# EAGLE design RGB-TestPatternGenerator (EAGLE 9.6.2)
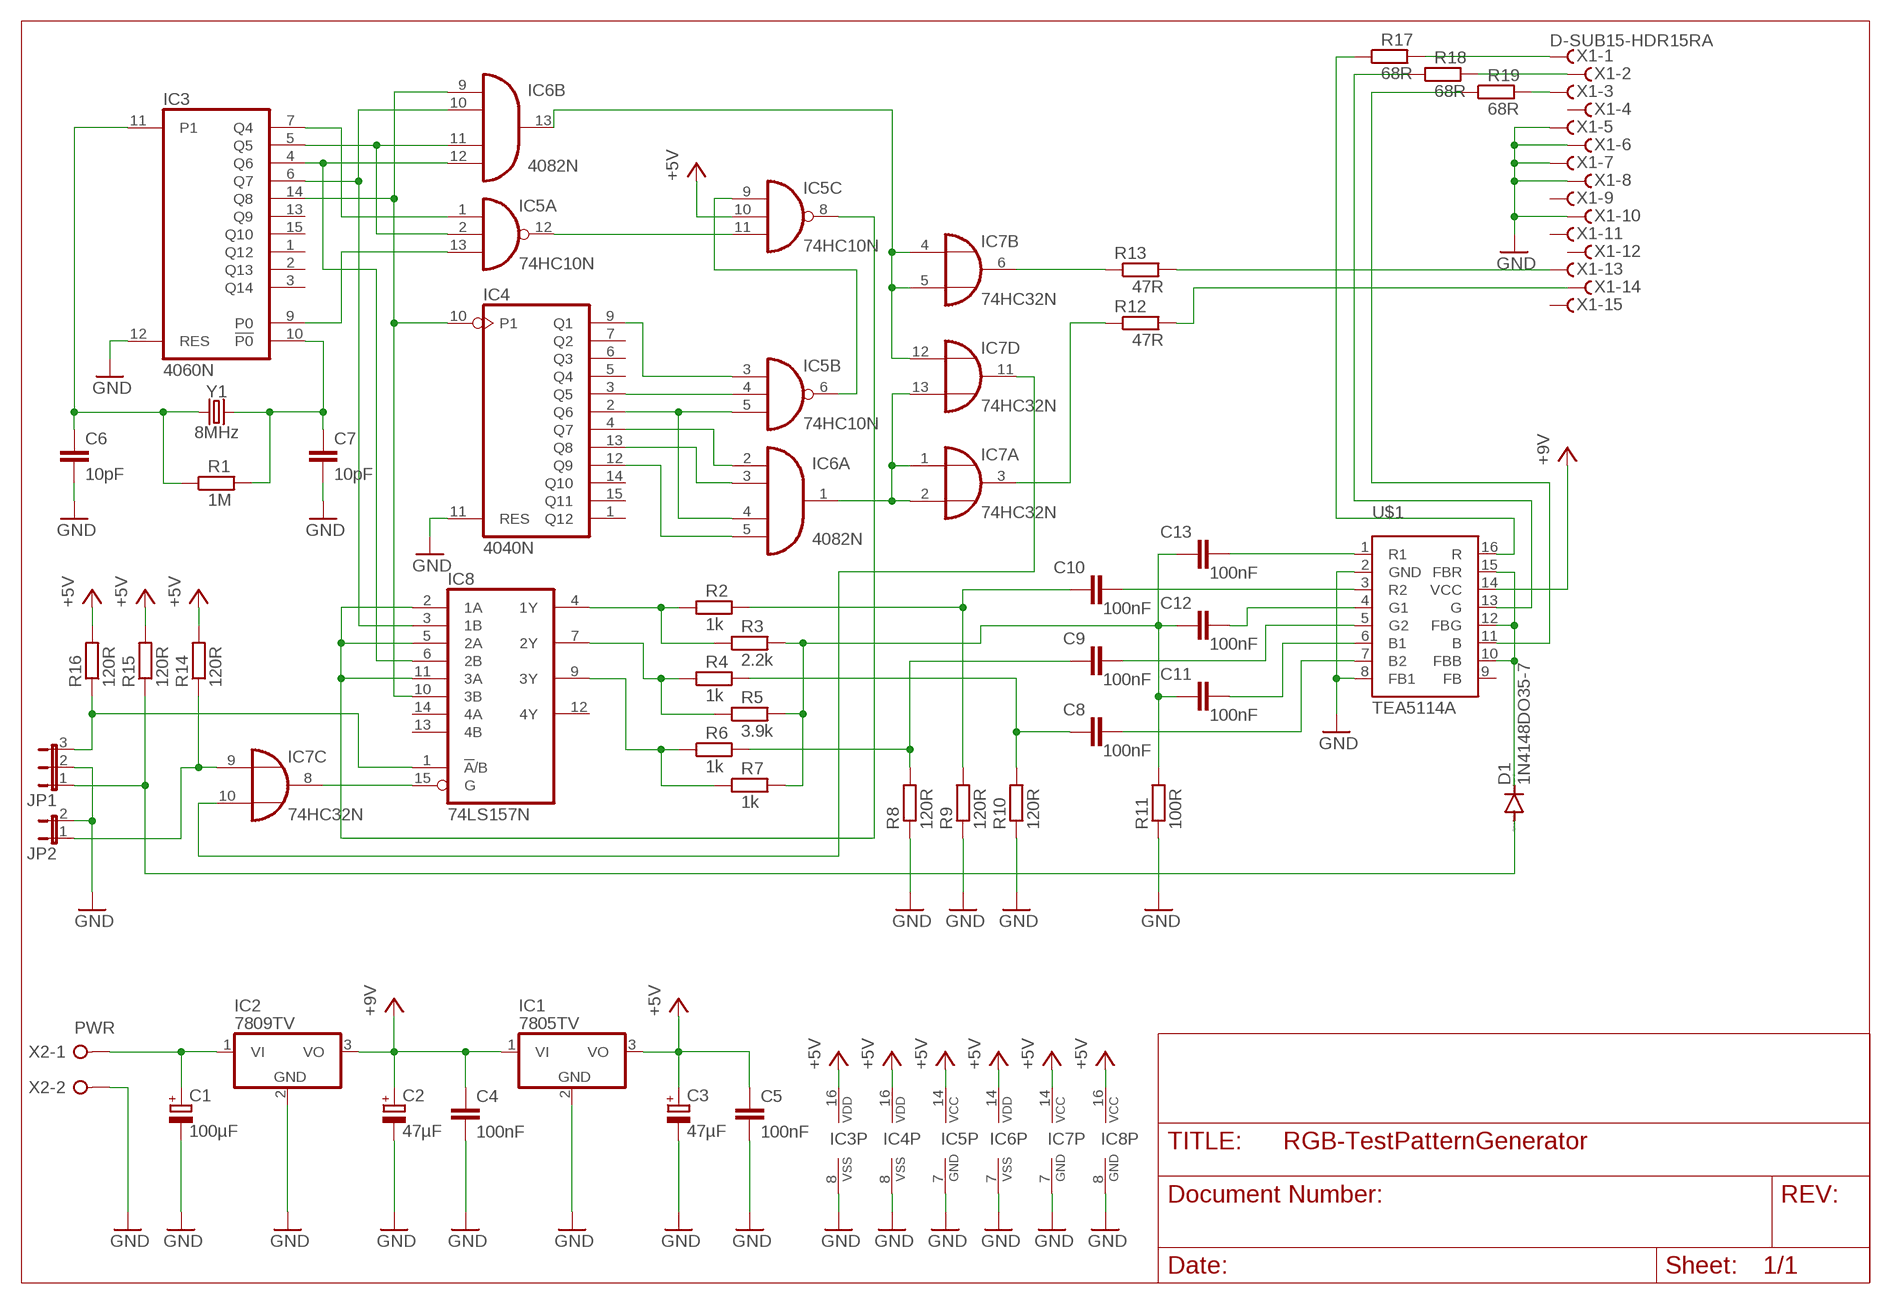
[diagram p0: schematic, sheet 1]

## Parts
C1  100µF  CPOL-EUE2,5-6E  [E2,5-6E]
C2  47µF  CPOL-EUE2-5  [E2-5]
C3  47µF  CPOL-EUE2-5  [E2-5]
C4  100nF  C-EU050-024X044  [C050-024X044]
C5  100nF  C-EU050-024X044  [C050-024X044]
C6  10pF  C-EU050-024X044  [C050-024X044]
C7  10pF  C-EU050-024X044  [C050-024X044]
C8  100nF  C-EU050-024X044  [C050-024X044]
C9  100nF  C-EU050-024X044  [C050-024X044]
C10  100nF  C-EU050-024X044  [C050-024X044]
C11  100nF  C-EU050-024X044  [C050-024X044]
C12  100nF  C-EU050-024X044  [C050-024X044]
C13  100nF  C-EU050-024X044  [C050-024X044]
D1  1N4148DO35-7  [DO35-7]
IC1  7805TV  [TO220V]
IC2  7809TV  7805TV  [TO220V]
IC3  4060N  [DIL16]
IC4  4040N  [DIL16]
IC5  74HC10N  [DIL14]
IC6  4082N  [DIL14]
IC7  74HC32N  [DIL14]
IC8  74LS157N  [DIL16]
JP1  JP2E  [JP2]
JP2  JP1E  [JP1]
R1  1M  R-EU_0207/10  [0207/10]
R2  1k  R-EU_0207/10  [0207/10]
R3  2.2k  R-EU_0207/10  [0207/10]
R4  1k  R-EU_0207/10  [0207/10]
R5  3.9k  R-EU_0207/10  [0207/10]
R6  1k  R-EU_0207/10  [0207/10]
R7  1k  R-EU_0207/10  [0207/10]
R8  120R  R-EU_0207/10  [0207/10]
R9  120R  R-EU_0207/10  [0207/10]
R10  120R  R-EU_0207/10  [0207/10]
R11  100R  R-EU_0207/10  [0207/10]
R12  47R  R-EU_0207/10  [0207/10]
R13  47R  R-EU_0207/10  [0207/10]
R14  120R  R-EU_0207/10  [0207/10]
R15  120R  R-EU_0207/10  [0207/10]
R16  120R  R-EU_0207/10  [0207/10]
R17  68R  R-EU_0207/10  [0207/10]
R18  68R  R-EU_0207/10  [0207/10]
R19  68R  R-EU_0207/10  [0207/10]
U$1  TEA5114A  RGBTEA5114A  [TEA5114A]
X1  D-SUB15-HDR15RA  [HDR15RA]
X2  PWR  W237-02P  [W237-132]
Y1  8MHz  CRYSTALPTH-HC49US  [HC49US]

## Nets
+5V: C3.+ C5.1 IC1.3(VO) IC3.16(VDD) IC4.16(VDD) IC5.10(C:I1) IC5.14(P:VCC) IC6.14(P:VDD) IC7.14(P:VCC) IC8.16(VCC) R14.2 R15.2 R16.2
GND: C1.- C2.- C3.- C4.2 C5.2 C6.2 C7.2 IC1.2(GND) IC2.2(GND) IC3.8(VSS) IC3.12(RES) IC4.8(VSS) IC4.11(RES) IC5.7(P:GND) IC6.7(P:VSS) IC7.7(P:GND) IC8.8(GND) JP1.2 JP2.2 R8.1 R9.1 R10.1 R11.1 U$1.2(GND) U$1.8(FB1) X1.5 X1.6 X1.7 X1.8 X1.10 X2.2
N$1: C1.+ IC2.1(VI) X2.1
N$2: C6.1 IC3.11(P1) R1.1 Y1.1
N$3: C7.1 IC3.10(!P0) R1.2 Y1.2
N$4: IC3.5(Q5) IC5.2(A:I1) IC6.11(B:I2)
N$5: IC3.4(Q6) IC6.12(B:I3) IC8.6(2B)
N$6: IC3.7(Q4) IC5.1(A:I0)
N$7: IC3.9(P0) IC5.13(A:I2)
N$8: IC3.6(Q7) IC6.10(B:I1) IC8.3(1B)
N$9: IC3.14(Q8) IC4.10(P1) IC6.9(B:I0) IC8.10(3B)
N$10: IC5.8(C:O) IC8.2(1A) IC8.5(2A) IC8.11(3A)
N$11: IC7.8(C:O) IC8.15(G)
N$12: IC4.2(Q6) IC5.5(B:I2) IC6.4(A:I2)
N$13: IC4.3(Q5) IC5.4(B:I1)
N$14: IC4.9(Q1) IC5.3(B:I0)
N$15: IC4.4(Q7) IC6.2(A:I0)
N$16: IC4.13(Q8) IC6.3(A:I1)
N$17: IC5.11(C:I2) IC5.12(A:O)
N$18: IC4.12(Q9) IC6.5(A:I3)
N$19: IC5.6(B:O) IC5.9(C:I0)
N$20: IC6.1(A:O) IC7.1(A:I0) IC7.2(A:I1) IC7.13(D:I1)
N$21: IC8.4(1Y) R2.1 R3.1
N$22: IC6.13(B:O) IC7.4(B:I0) IC7.5(B:I1) IC7.12(D:I0)
N$23: IC8.7(2Y) R4.1 R5.1
N$24: IC8.9(3Y) R6.1 R7.1
N$25: C11.1 C12.1 C13.1 R3.2 R5.2 R7.2 R11.2
N$26: C9.1 R6.2 R8.2
N$27: C10.1 R2.2 R9.2
N$28: C8.1 R4.2 R10.2
N$29: IC7.10(C:I1) IC7.11(D:O)
N$30: IC7.6(B:O) R13.1
N$31: IC7.3(A:O) R12.1
N$32: IC7.9(C:I0) JP2.1 R14.1
N$33: IC8.1(!A!/B) JP1.3 R16.1
N$34: R13.2 X1.13
N$35: R12.2 X1.14
N$36: R17.2 X1.1
N$37: D1.A JP1.1 R15.1
N$38: R18.2 X1.2
N$39: R19.2 X1.3
N$40: R17.1 U$1.16(R)
N$41: R18.1 U$1.13(G)
N$42: R19.1 U$1.11(B)
N$43: C13.2 U$1.1(R1)
N$44: C10.2 U$1.3(R2)
N$45: C12.2 U$1.4(G1)
N$46: C9.2 U$1.5(G2)
N$47: C11.2 U$1.6(B1)
N$48: C8.2 U$1.7(B2)
N$49: D1.C U$1.10(FBB) U$1.12(FBG) U$1.15(FBR)
VCC: C2.+ C4.1 IC1.1(VI) IC2.3(VO) U$1.14(VCC) ; supply symbol labelled +9V
Unconnected: IC3.1(Q12) IC3.2(Q13) IC3.3(Q14) IC3.13(Q9) IC3.15(Q10) IC4.1(Q12) IC4.5(Q4) IC4.6(Q3) IC4.7(Q2) IC4.14(Q10) IC4.15(Q11) IC8.12(4Y) IC8.13(4B) IC8.14(4A) U$1.9(FB) X1.4 X1.9 X1.11 X1.12 X1.15

## Library data of the parts
C1-C3 = rcl:CPOL-EU: POLARIZED CAPACITOR, European symbol; SPICEPREFIX: C
C4-C13 = rcl:C-EU: CAPACITOR, European symbol; SPICEPREFIX: C
D1 = diode:1N4148: DIODE high speed (Philips)
IC1 IC2 = linear:78*: Positive VOLTAGE REGULATOR Source: http://cache.national.com/ds/LM/LM78L05.pdf http://www.fairchildsemi.com/ds/LM/LM7805.pdf
IC3 = 40xx:4060: 14-stage binary/ripple COUNTER
IC4 = 40xx:4040: 12-stage binary/ripple COUNTER
IC5 = 74xx-eu:74*10: Triple 3-input NAND gate
IC6 = 40xx:4082: Dual 4-input AND
IC7 = 74xx-eu:74*32: Quad 2-input OR gate
IC8 = 74xx-eu:74*157: Quadruple 2-line to 1-line data SELECTOR/MULTIPLEXER
JP1 = jumper:JP2E: JUMPER
JP2 = jumper:JP1E: JUMPER
R1-R19 = rcl:R-EU_: RESISTOR, European symbol; SPICEPREFIX: R
U$1 = bb84:RGB: This integrated circuit provides RGB switching allowing connections between peri TV plug, internal RGB generator and video processor in a TV set. The input signal black level is tied to the same reference voltageon each input in order to haveno differential voltage when switching two RGB generators. An AC output signal higher than 2 Vpp makes gain goingslowly down to 0dBto protect the TV set video amplifier from saturation. Fast blanking output is a logicial OR between FB1 (Pin 8) and FB2 (Pin 10). 1996 SGS-THOMSON Microelectronics - All Rights Reserved
X1 = con-thomas-betts:D-SUB15-: D-Subminiatur Connector Source: Electronioc Interconnects European Edition 1998; OC_FARNELL: unknown; OC_NEWARK: unknown
X2 = con-wago-508:W237-02P: WAGO SREW CLAMP; OC_FARNELL: unknown; OC_NEWARK: unknown
Y1 = SparkFun-Clocks:CRYSTAL: Crystals (Generic) These are passive quartz crystals, which can be used as a clock source for a microcontroller. Crystal's are two-terminal devices. They require external "load" capacitors to generate an oscillating signal.

## Board
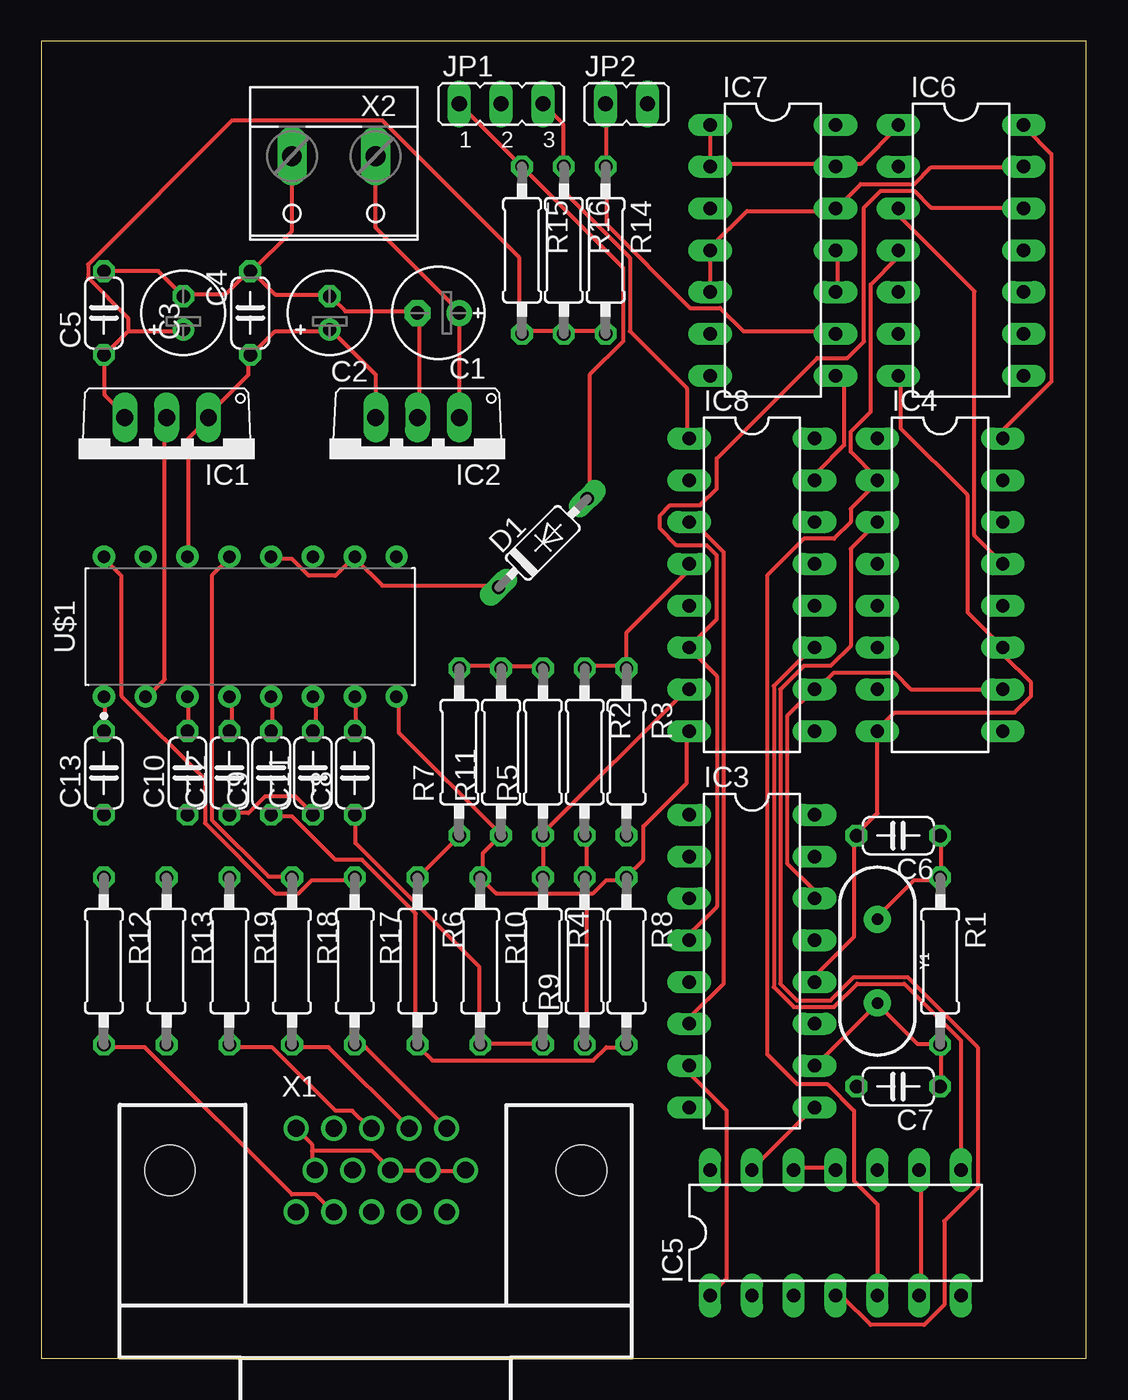
[diagram p1: board, top side]
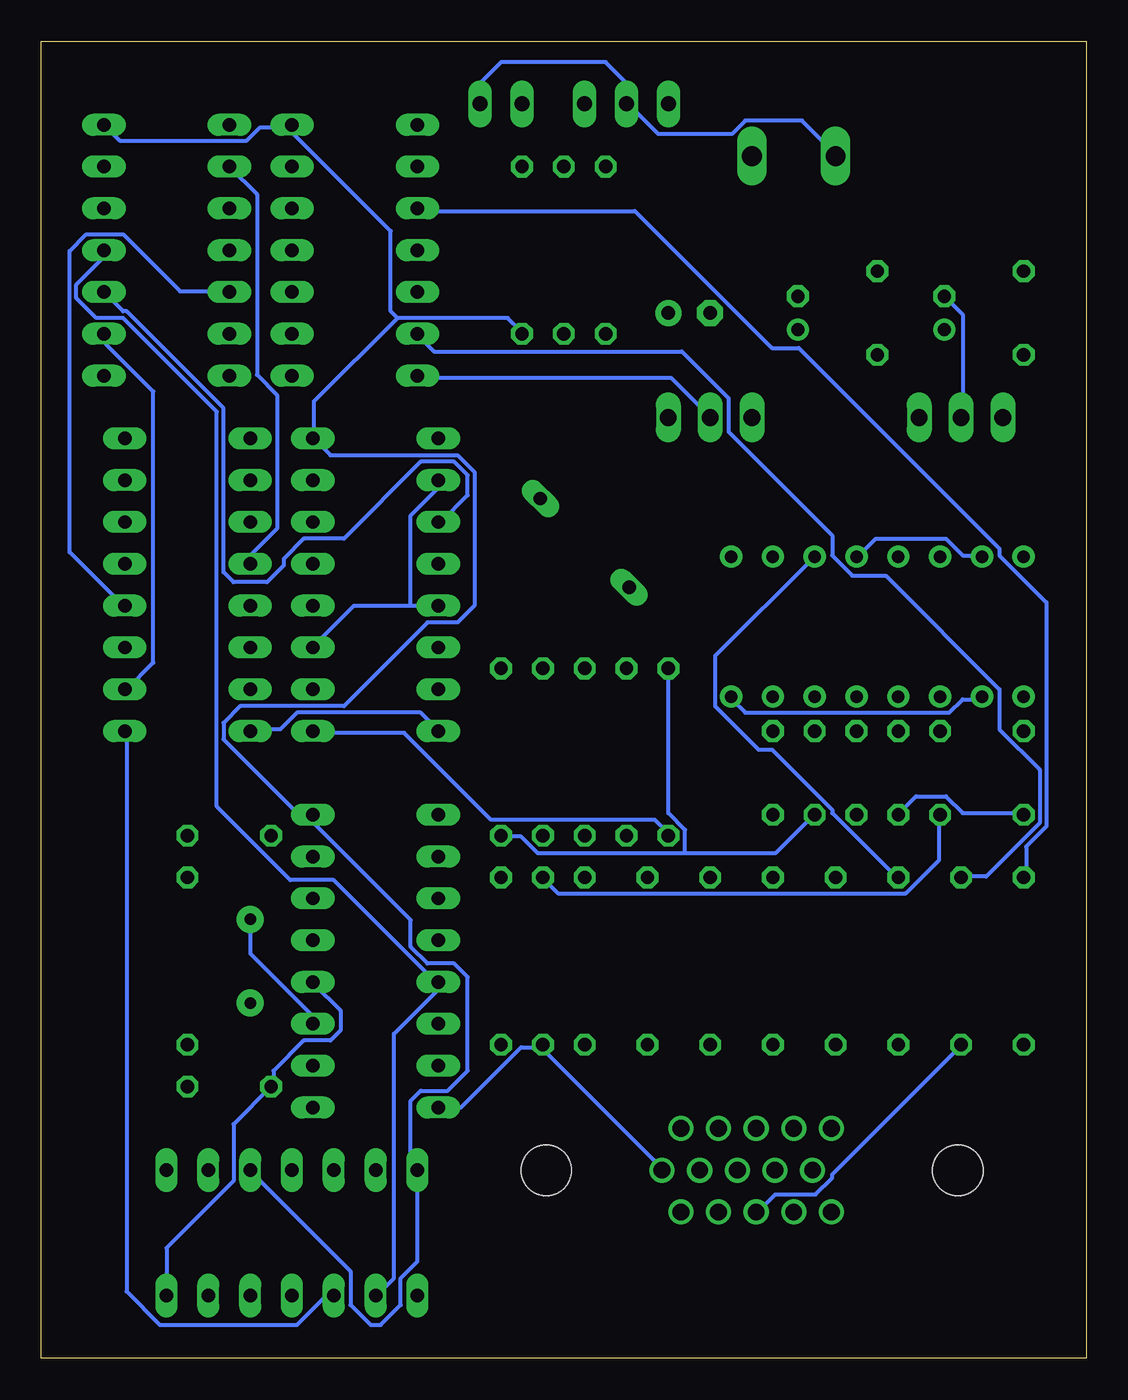
[diagram p2: board, bottom side, seen from below]

Size 63.5 x 80.01 mm. Coordinates in mm from the lower left corner, seen from the top.
Outline: 0,0 63.5,0 63.5,80.01 0,80.01 0,0
Copper layers (1*16): Top 0.035mm / dielectric 1.5mm / Bottom 0.035mm
Design rules "default *": minimum track width 10mil, minimum drill 0.35mm, track to track 6mil, track to pad 6mil, pad to pad 6mil, via to via 6mil, smd to smd 6mil, copper to edge 40mil, drill to drill 6mil, minimum pad ring 10mil, minimum via ring 8mil, stop-mask expansion 4mil, vias tented up to drill 0mil, thermal gap 10mil

### Footprints (pad centres in the part's own frame; a part is rotated, then mirrored left to right if it is on the bottom)
E2,5-6E = drill 0.813 pad 1.575: + -1.27,0 | drill 0.813 pad 1.575 octagon: - 1.27,0
E2-5 = drill 0.813 pad 1.27: + -1.016,0 | drill 0.813 pad 1.27 octagon: - 1.016,0
C050-024X044 = drill 0.813 octagon: 1 -2.54,0; 2 2.54,0
DO35-7 = drill 0.813 long: A 3.81,0; C -3.81,0
TO220V = drill 1.016 long: 1 -2.54,-2.54; 2 0,-2.54; 3 2.54,-2.54
DIL16 = drill 0.813 long: 1 -8.89,-3.81; 2 -6.35,-3.81; 3 -3.81,-3.81; 4 -1.27,-3.81; 5 1.27,-3.81; 6 3.81,-3.81; 7 6.35,-3.81; 8 8.89,-3.81; 9 8.89,3.81; 10 6.35,3.81; 11 3.81,3.81; 12 1.27,3.81; 13 -1.27,3.81; 14 -3.81,3.81; 15 -6.35,3.81; 16 -8.89,3.81
DIL14 = drill 0.813 long: 1 -7.62,-3.81; 2 -5.08,-3.81; 3 -2.54,-3.81; 4 0,-3.81; 5 2.54,-3.81; 6 5.08,-3.81; 7 7.62,-3.81; 8 7.62,3.81; 9 5.08,3.81; 10 2.54,3.81; 11 0,3.81; 12 -2.54,3.81; 13 -5.08,3.81; 14 -7.62,3.81
JP2 = drill 0.914 long: 1 -2.54,0; 2 0,0; 3 2.54,0
JP1 = drill 0.914 long: 1 0,-1.27; 2 0,1.27
0207/10 = drill 0.813 octagon: 1 -5.08,0; 2 5.08,0
TEA5114A = drill 0.759 pad 1.359: 1 -4.25,8.89; 2 -4.25,6.35; 3 -4.25,3.81; 4 -4.25,1.27; 5 -4.25,-1.27; 6 -4.25,-3.81; 7 -4.25,-6.35; 8 -4.25,-8.89; 9 4.25,-8.89; 10 4.25,-6.35; 11 4.25,-3.81; 12 4.25,-1.27; 13 4.25,1.27; 14 4.25,3.81; 15 4.25,6.35; 16 4.25,8.89
HDR15RA = drill 1.016: 1 4.318,2.54; 2 2.032,2.54; 3 -0.254,2.54; 4 -2.54,2.54; 5 -4.826,2.54; 6 5.461,0; 7 3.175,0; 8 0.889,0; 9 -1.397,0; 10 -3.683,0; 11 4.318,-2.54; 12 2.032,-2.54; 13 -0.254,-2.54; 14 -2.54,-2.54; 15 -4.826,-2.54 | hole 3.048: -12.497,0; 12.497,0
W237-132 = drill 1.194 long: 1 -2.54,-0.635; 2 2.54,-0.635
HC49US = drill 0.7 pad 1.651: 1 -2.54,0; 2 2.54,0

### Placement (x,y rotation side)
C1  24.13,63.5 180 top
C2  17.53,63.5 90 top
C3  8.64,63.5 90 top
C4  12.7,63.5 90 top
C5  3.81,63.5 90 top
C6  52.07,31.75 180 top
C7  52.07,16.51 180 top
C8  19.05,35.56 90 top
C9  13.97,35.56 90 top
C10  8.89,35.56 90 top
C11  16.51,35.56 90 top
C12  11.43,35.56 90 top
C13  3.81,35.56 90 top
D1  30.48,49.53 45 top
IC1  7.62,54.61 180 top
IC2  22.86,54.61 180 top
IC3  43.18,24.13 270 top
IC4  54.61,46.99 270 top
IC5  48.26,7.62 0 top
IC6  55.88,67.31 270 top
IC7  44.45,67.31 270 top
IC8  43.18,46.99 270 top
JP1  27.94,76.2 0 top
JP2  35.56,76.2 270 top
R1  54.61,24.13 270 top
R2  33.02,36.83 270 top
R3  35.56,36.83 270 top
R4  30.48,24.13 270 top
R5  30.48,36.83 90 top
R6  22.86,24.13 270 top
R7  25.4,36.83 90 top
R8  35.56,24.13 270 top
R9  33.02,24.13 90 top
R10  26.67,24.13 270 top
R11  27.94,36.83 90 top
R12  3.81,24.13 270 top
R13  7.62,24.13 270 top
R14  34.29,67.31 270 top
R15  29.21,67.31 270 top
R16  31.75,67.31 270 top
R17  19.05,24.13 270 top
R18  15.24,24.13 270 top
R19  11.43,24.13 270 top
U$1  12.7,44.45 90 top
X1  20.32,11.43 0 top
X2  17.78,72.39 180 top
Y1  50.8,24.13 270 top

### Tracks (layer width: path | path; a pad name or v marks a point on that pad's centre or on a via)
+5V
  Top 0.254: IC4.16 58.52,55.88 58.52,56.49 61.37,59.33 61.37,73.15 59.74,74.78 IC6.14 | 3.86,60.96 3.86,58.52 5.08,57.3 IC1.3 | 5.28,62.38 8.53,62.38 C3.+ | 3.86,60.96 5.28,62.38 | 3.86,60.96 C5.1 | R14.2 34.14,62.38 31.9,62.38 R16.2 31.7,62.38 29.26,62.38 R15.2 29.06,62.38 29.06,66.85 20.73,75.18 11.58,75.18 2.85,66.45 2.85,65.63 5.28,63.2 5.28,62.38
  Bottom 0.254: IC5.10 50.8,11.38 44.7,5.28 44.7,3.25 43.48,2.03 42.88,2.03 41.66,3.25 41.66,4.88 40.64,5.89 IC5.14 40.64,11.58 41.05,11.99 41.05,15.65 40.44,16.26 38.81,16.26 37.59,17.48 37.59,23.16 38.41,23.98 40.03,23.98 41.05,24.99 41.05,26.62 46.94,32.51 46.94,32.92 IC3.16 47.14,33.12 47.95,33.12 52.43,37.59 52.43,38.61 51.41,39.62 45.11,39.62 40.03,44.7 38.2,44.7 37.19,45.72 37.19,53.85 38.2,54.86 45.92,54.86 46.94,55.88 | IC6.14 58.73,73.97 51,73.97 50.19,74.78 48.36,74.78 IC7.14 48.16,74.78 48.16,74.37 42.27,68.48 42.27,63.6 41.86,63.2 | 46.94,55.88 46.94,58.12 41.86,63.2 | 41.86,63.2 35.15,63.2 34.34,62.38 R14.2 | 46.94,55.88 IC8.16
GND
  Top 0.254: IC3.12 47.14,22.96 47.14,23.37 49.38,25.6 49.38,31.7 C6.2 49.58,31.9 50.8,33.12 IC4.8 50.8,38.2 51.82,39.22 59.13,39.22 60.15,40.23 60.15,41.05 58.52,42.67 58.52,43.08 IC4.11 56.29,45.31 56.29,52.43 52.22,56.49 52.22,59.54 IC6.7 | C5.2 7.11,66.04 C3.- 8.74,64.62 11.18,64.62 12.6,66.04 C4.2 12.8,66.04 | 12.8,66.04 14.22,64.62 17.48,64.62 C2.- 17.68,64.41 18.49,63.6 22.76,63.6 C1.- 22.96,63.4 22.96,57.3 IC2.2 | X2.2 15.24,68.48 12.8,66.04 | 16.46,12.6 16.46,13.01 X1.5 | 16.46,12.6 16.46,11.58 X1.10 | X1.6 25.6,11.38 23.57,11.38 X1.7 23.37,11.38 21.34,11.38 X1.8 21.13,11.58 20.12,12.6 16.46,12.6 | 33.12,28.25 27.64,28.25 R10.1 26.82,29.26 26.82,30.68 27.84,31.7 R11.1 27.84,31.9 21.74,38 21.74,40.03 U$1.8 | 33.12,28.25 33.53,28.25 34.34,29.06 35.56,29.06 R8.1 35.56,29.26 36.58,30.28 36.58,32.31 39.22,34.95 39.22,38 IC8.8 | 33.12,28.25 33.12,19.1 R9.1 | IC1.2 7.52,57.1 7.52,41.25 6.5,40.23 U$1.2
  Bottom 0.254: IC3.12 46.94,22.76 45.31,21.13 45.31,19.91 45.92,19.3 47.55,19.3 49.38,17.48 49.38,16.66 C7.2 51.82,14.22 51.82,10.77 55.88,6.71 IC5.7 | IC7.7 40.64,59.54 25.2,59.54 22.96,57.3 IC2.2 | C3.- 7.52,63.4 7.52,57.3 IC1.2 | X2.2 15.24,73.15 17.27,75.18 20.73,75.18 21.54,74.37 26.01,74.37 27.84,76.2 JP1.2 27.94,77.47 29.21,78.74 35.56,78.74 36.83,77.47 JP2.2 | U$1.2 6.5,40.03 7.52,40.03 8.33,39.22 20.73,39.22 21.54,40.03 U$1.8 | 33.12,18.9 34.34,18.9 38,15.24 IC3.8 | 33.12,18.9 25.81,11.58 X1.6 | 33.12,18.9 R9.1 | IC4.8 50.8,38.2 48.97,38.2 47.95,39.22 40.44,39.22 39.42,38.2 IC8.8
N$1
  Top 0.254: IC2.1 C1.+ 25.4,63.6 20.32,68.68 X2.1
N$2
  Top 0.254: C6.1 54.66,31.7 54.66,29.26 R1.1 54.46,29.06 53.03,29.06 50.8,26.82 Y1.1
  Bottom 0.254: Y1.1 50.8,24.59 47.14,20.93 47.14,20.32 IC3.11
N$3
  Top 0.254: C7.1 54.66,16.66 54.66,18.9 R1.2 54.46,19.1 53.24,19.1 50.8,21.54 | 50.8,21.54 47.14,17.88 IC3.10 | 50.8,21.54 Y1.2
N$4
  Bottom 0.254: 39.42,22.76 39.42,22.35 42.06,19.71 42.06,4.88 43.08,3.86 IC5.2 | 39.42,22.76 45.72,29.06 48.36,29.06 52.83,33.53 52.83,57.51 58.52,63.2 60.15,63.2 61.37,64.41 61.37,65.23 59.74,66.85 59.74,67.26 IC6.11 | 39.42,22.76 IC3.5
N$5
  Top 0.254: IC3.4 39.42,25.4 39.42,25.81 41.05,27.43 41.05,41.45 39.42,43.08 IC8.6 39.42,43.28 41.05,44.91 41.05,48.77 40.44,49.38 38.61,49.38 37.59,50.39 37.59,51.21 38.2,51.82 40.03,51.82 41.05,52.83 41.05,54.66 47.14,60.76 48.97,60.76 49.99,61.77 49.99,69.9 51,70.92 53.03,70.92 54.05,69.9 59.54,69.9 IC6.12
N$6
  Top 0.254: IC3.7 39.42,17.68 39.42,17.27 41.66,15.04 41.66,4.88 40.64,3.86 IC5.1
N$7
  Top 0.254: IC5.13 43.28,11.58 46.94,15.24 IC3.9
N$8
  Top 0.254: IC8.3 39.62,50.8 41.45,48.97 41.45,22.76 39.42,20.73 39.42,20.32 IC3.6
  Bottom 0.254: IC6.10 58.52,63.6 58.32,63.6 52.43,57.71 52.43,47.75 51.82,47.14 49.78,47.14 48.77,48.16 48.77,48.56 47.55,49.78 45.11,49.78 40.44,54.46 38.41,54.46 37.59,53.65 37.59,52.43 39.22,50.8 IC8.3
N$9
  Top 0.254: IC3.14 46.94,28.04 46.94,28.45 45.31,30.07 45.31,39.01 46.94,40.64 IC8.10 47.14,40.64 48.16,41.66 51.82,41.66 52.83,40.64 IC4.10
  Bottom 0.254: IC6.9 59.54,62.18 59.54,61.57 56.69,58.73 56.69,42.27 58.32,40.64 IC4.10
N$10
  Top 0.254: IC5.8 55.88,19.3 52.43,22.76 49.58,22.76 48.16,21.34 45.72,21.34 44.5,22.55 44.5,40.84 46.94,43.28 IC8.11
  Bottom 0.254: 41.05,45.72 44.5,45.72 46.94,43.28 IC8.11 | 41.05,45.72 IC8.5 | 41.05,45.72 41.05,51.21 39.42,52.83 39.42,53.24 IC8.2
N$11
  Top 0.254: IC8.15 47.14,53.44 47.14,53.85 48.77,55.47 48.77,59.13 48.36,59.54 IC7.8
N$12
  Top 0.254: IC5.5 50.8,9.35 49.38,10.77 49.38,15.04 47.75,16.66 45.92,16.66 44.09,18.49 44.09,47.55 46.33,49.78 48.16,49.78 49.17,50.8 49.17,51.61 50.8,53.24 IC4.2 50.8,53.44 49.17,55.07 49.17,56.29 50.39,57.51 50.39,65.23 52.02,66.85 52.02,67.26 IC6.4
N$13
  Top 0.254: IC4.3 49.17,49.17 49.17,43.28 47.95,42.06 46.33,42.06 44.91,40.64 44.91,22.76 45.92,21.74 47.95,21.74 49.38,23.16 52.63,23.16 56.9,18.9 56.9,10.36 54.86,8.33 54.86,3.25 53.65,2.03 50.39,2.03 48.77,3.66 48.36,3.66 IC5.4
N$14
  Bottom 0.254: IC5.3 45.72,3.66 46.33,3.66 47.95,2.03 56.29,2.03 58.32,4.06 58.32,38 IC4.9
N$15
  Bottom 0.254: IC4.4 50.8,48.77 49.17,50.39 49.17,58.52 50.39,59.74 50.39,70.71 IC6.2
N$16
  Top 0.254: IC4.13 56.69,49.99 56.69,64.82 52.22,69.29 52.22,69.7 IC6.3
N$17
  Top 0.254: IC5.12 45.72,11.58 48.16,11.58 IC5.11
N$18
  Bottom 0.254: IC6.5 52.22,64.82 55.07,64.82 58.52,68.28 60.76,68.28 61.77,67.26 61.77,48.97 58.52,45.72 IC4.12
N$19
  Top 0.254: IC5.6 53.44,3.86 53.44,11.38 IC5.9
N$20
  Top 0.254: IC7.1 40.64,72.54 | IC6.1 52.02,74.78 49.78,72.54 48.36,72.54 IC7.13 48.16,72.54 40.64,72.54 | 40.64,72.54 IC7.2
N$21
  Top 0.254: 35.56,42.06 33.12,42.06 R2.1 | 35.56,42.06 35.56,44.09 39.22,47.75 39.22,48.16 IC8.4 | 35.56,42.06 R3.1
N$22
  Top 0.254: IC7.5 IC7.4 40.64,67.46 42.88,69.7 48.16,69.7 IC7.12 48.36,69.9 49.78,71.32 53.03,71.32 54.05,72.34 59.54,72.34 IC6.13
N$23
  Top 0.254: R4.1 R5.1 30.48,31.9 39.22,40.64 IC8.7
N$24
  Top 0.254: R6.1 22.96,29.26 25.4,31.7 R7.1
  Bottom 0.254: IC8.9 46.94,38 41.45,38 36.17,32.72 26.21,32.72 25.4,31.9 R7.1
N$25
  Top 0.254: R7.2 25.4,42.06 27.84,42.06 R11.2 28.04,42.06 30.48,42.06 R5.2 | C12.1 11.58,33.12 12.6,33.12 13.61,34.14 15.44,34.14 16.46,33.12 C11.1
  Bottom 0.254: C13.1 3.86,33.12 7.52,33.12 8.53,34.14 10.36,34.14 11.38,33.12 C12.1 | 24.38,30.68 18.9,30.68 16.66,32.92 C11.1 | 24.38,30.68 33.33,30.68 34.34,31.7 35.56,31.7 R3.2 | R7.2 25.4,33.12 24.38,32.11 24.38,30.68
N$26
  Top 0.254: C9.1 14.02,32.92 15.24,32.92 17.88,30.28 19.51,30.28 22.76,27.03 22.76,19.1 R6.2 22.96,18.9 23.77,18.09 33.53,18.09 34.34,18.9 35.56,18.9 R8.2
N$27
  Top 0.254: R9.2 33.12,29.26 33.12,31.7 R2.2
  Bottom 0.254: C10.1 8.94,32.92 8.94,30.28 10.97,28.25 32.11,28.25 32.92,29.06 R9.2
N$28
  Top 0.254: R4.2 30.48,19.1 26.82,19.1 R10.2 26.62,19.1 26.62,23.77 19.1,31.29 19.1,32.92 C8.1
N$29
  Top 0.254: IC7.10 48.36,64.82 48.36,67.26 IC7.11
N$30
  Bottom 0.254: R13.1 7.52,29.26 6.1,29.26 2.85,32.51 2.85,35.76 5.28,38.2 5.28,40.64 12.19,47.55 14.22,47.55 15.44,48.77 15.44,49.99 21.74,56.29 21.74,58.32 24.59,61.16 39.62,61.16 40.64,62.18 IC7.6
N$31
  Bottom 0.254: R12.1 3.66,29.26 3.66,31.09 2.44,32.31 2.44,45.92 5.28,48.77 5.28,49.17 17.48,61.37 19.1,61.37 27.43,69.7 40.64,69.7 IC7.3
N$32
  Top 0.254: IC7.9 48.16,62.38 42.67,62.38 41.25,63.8 39.42,63.8 34.34,68.89 34.34,72.34 R14.1 34.34,72.54 34.34,76.2 JP2.1
N$33
  Top 0.254: JP1.3 31.7,74.98 31.7,72.54 R16.1 31.9,72.34 31.9,70.71 35.76,66.85 35.76,62.38 39.22,58.93 39.22,55.88 IC8.1
N$34
  Bottom 0.254: R13.2 7.72,18.9 15.44,11.18 15.44,10.97 16.46,9.96 18.9,9.96 19.91,8.94 X1.13
N$35
  Top 0.254: R12.2 3.86,18.9 6.3,18.9 15.24,9.96 16.66,9.96 17.68,8.94 X1.14
N$36
  Top 0.254: X1.1 19.71,18.9 19.1,18.9 R17.2
N$37
  Top 0.254: JP1.1 R15.1 35.36,66.24 35.36,61.77 33.33,59.74 33.33,52.43 D1.A
N$38
  Top 0.254: R18.2 15.24,18.9 17.48,18.9 22.35,14.02 X1.2
N$39
  Top 0.254: R19.2 11.58,18.9 14.02,18.9 17.88,15.04 18.9,15.04 19.91,14.02 X1.3
N$40
  Top 0.254: R17.1 18.9,29.06 16.46,29.06 15.65,28.25 14.22,28.25 9.96,32.51 9.96,35.15 4.88,40.23 4.88,47.55 3.86,48.56 U$1.16
N$41
  Top 0.254: R18.1 15.24,29.26 13.82,29.26 10.36,32.72 10.36,47.55 11.38,48.56 U$1.13
N$42
  Bottom 0.254: R19.1 11.58,29.26 15.44,33.12 15.44,33.33 19.1,36.98 19.91,36.98 22.55,39.62 22.55,42.67 16.66,48.56 U$1.11
N$43
  Top 0.254: C13.2 3.86,38.2 3.86,40.03 U$1.1
N$44
  Top 0.254: C10.2 8.94,38.2 8.94,40.03 U$1.3
N$45
  Top 0.254: C12.2 11.58,38.2 11.58,40.03 U$1.4
N$46
  Top 0.254: C9.2 14.02,38.2 14.02,40.03 U$1.5
N$47
  Top 0.254: C11.2 16.66,38.2 16.66,40.03 U$1.6
N$48
  Top 0.254: C8.2 19.1,38.2 19.1,40.03 U$1.7
N$49
  Top 0.254: D1.C 27.64,46.94 20.73,46.94 19.1,48.56 U$1.10 18.9,48.56 17.88,47.55 16.26,47.55 15.24,48.56 14.02,48.56 U$1.12
  Bottom 0.254: U$1.15 6.5,48.77 7.52,48.77 8.53,49.78 12.8,49.78 13.82,48.77 U$1.12
VCC
  Top 0.254: U$1.14 8.94,48.77 8.94,55.88 10.16,57.1 IC1.1 10.16,57.3 12.6,59.74 12.6,60.96 C4.1 12.8,60.96 14.22,62.38 17.48,62.38 C2.+ 17.68,62.38 20.32,59.74 IC2.3